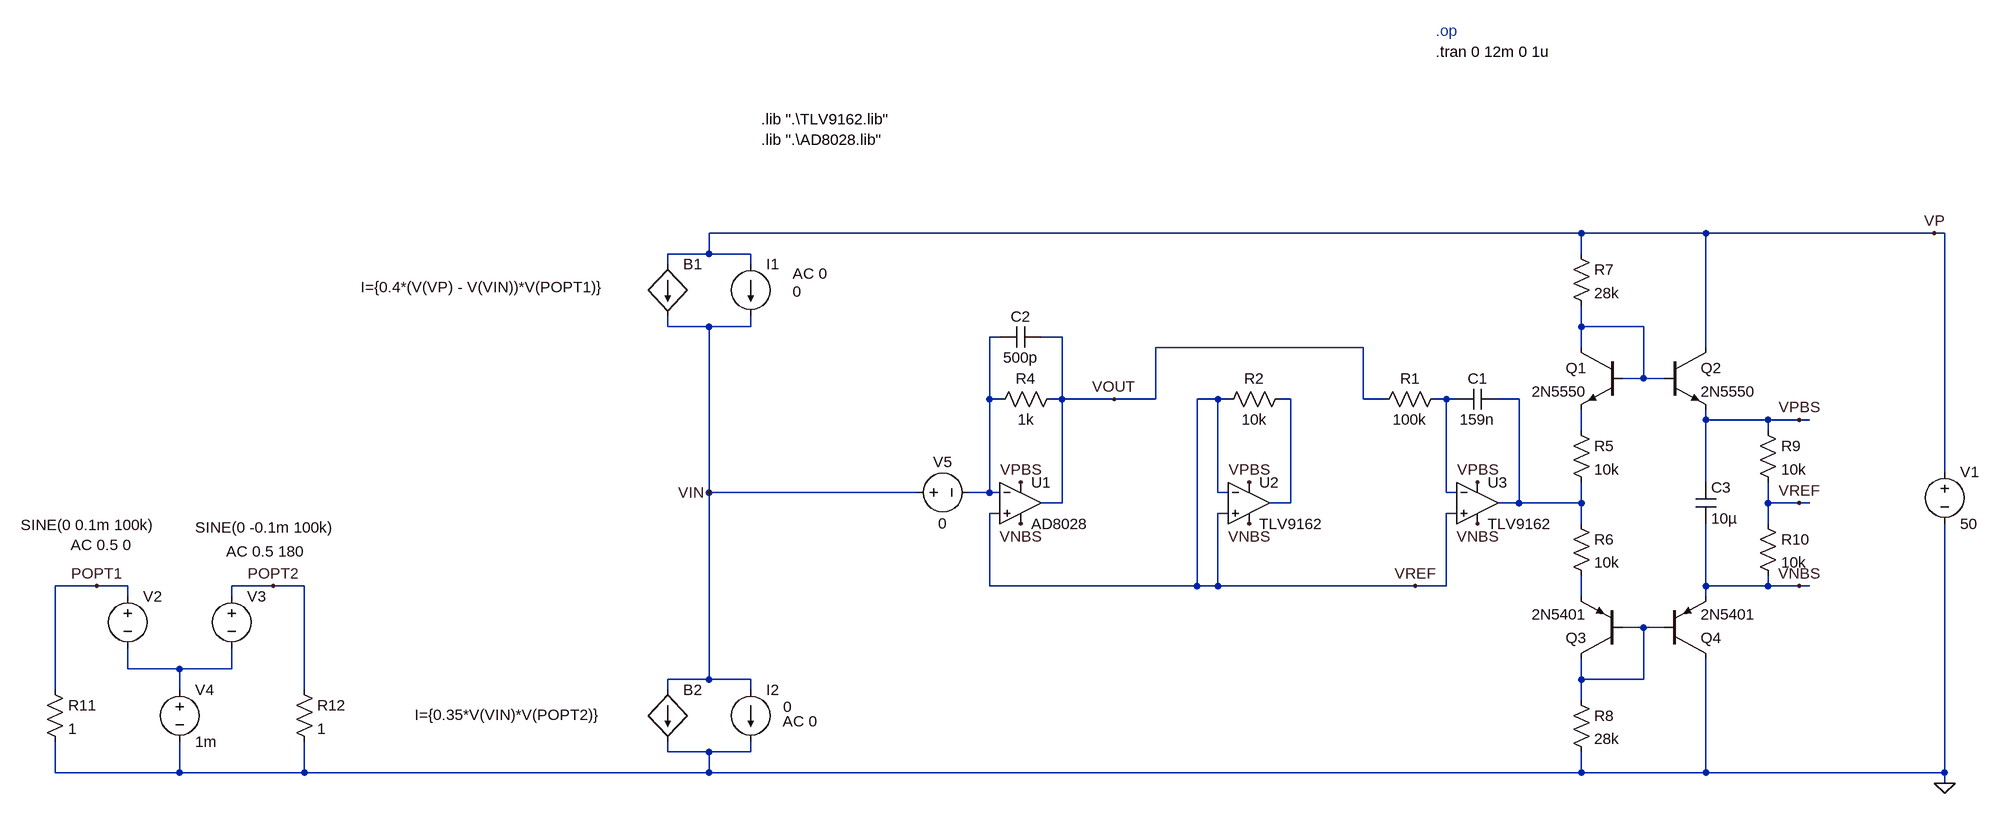
[diagram p0: schematic bootstrapping.asc]
bootstrapping.asc, the LTspice schematic file:
Version 4.1
SHEET 1 1864 1656
WIRE 1248 -48 -96 -48
WIRE 1440 -48 1248 -48
WIRE 1792 -48 1440 -48
WIRE 1808 -48 1792 -48
WIRE -96 -16 -96 -48
WIRE -96 -16 -160 -16
WIRE -32 -16 -96 -16
WIRE 1248 -16 1248 -48
WIRE -160 0 -160 -16
WIRE -32 0 -32 -16
WIRE -160 96 -160 80
WIRE -96 96 -160 96
WIRE -32 96 -32 80
WIRE -32 96 -96 96
WIRE 1248 96 1248 64
WIRE 1344 96 1248 96
WIRE 352 112 336 112
WIRE 448 112 416 112
WIRE 912 128 592 128
WIRE 1248 128 1248 96
WIRE 1440 128 1440 -48
WIRE 1344 176 1344 96
WIRE 1344 176 1312 176
WIRE 1376 176 1344 176
WIRE 336 208 336 112
WIRE 352 208 336 208
WIRE 448 208 448 112
WIRE 448 208 432 208
WIRE 528 208 448 208
WIRE 592 208 592 128
WIRE 592 208 528 208
WIRE 688 208 656 208
WIRE 704 208 688 208
WIRE 800 208 784 208
WIRE 912 208 912 128
WIRE 944 208 912 208
WIRE 1040 208 1024 208
WIRE 1056 208 1040 208
WIRE 1152 208 1120 208
WIRE 1440 240 1440 224
WIRE 1536 240 1440 240
WIRE 1584 240 1536 240
WIRE 1600 240 1584 240
WIRE 1248 256 1248 224
WIRE 1536 256 1536 240
WIRE 1808 320 1808 -48
WIRE 1440 336 1440 240
WIRE -96 352 -96 96
WIRE 224 352 -96 352
WIRE 336 352 336 208
WIRE 336 352 304 352
WIRE 352 352 336 352
WIRE 688 352 688 208
WIRE 704 352 688 352
WIRE 1040 352 1040 208
WIRE 1056 352 1040 352
WIRE 448 368 448 208
WIRE 448 368 416 368
WIRE 800 368 800 208
WIRE 800 368 768 368
WIRE 1152 368 1152 208
WIRE 1152 368 1120 368
WIRE 1248 368 1248 336
WIRE 1248 368 1152 368
WIRE 1536 368 1536 336
WIRE 1584 368 1536 368
WIRE 1600 368 1584 368
WIRE 352 384 336 384
WIRE 704 384 688 384
WIRE 1056 384 1040 384
WIRE 1248 400 1248 368
WIRE 1536 400 1536 368
WIRE -1040 496 -1104 496
WIRE -992 496 -1040 496
WIRE -768 496 -832 496
WIRE -720 496 -768 496
WIRE 336 496 336 384
WIRE 656 496 656 208
WIRE 656 496 336 496
WIRE 688 496 688 384
WIRE 688 496 656 496
WIRE 992 496 688 496
WIRE 1040 496 1040 384
WIRE 1040 496 992 496
WIRE 1440 496 1440 400
WIRE 1536 496 1536 480
WIRE 1536 496 1440 496
WIRE 1584 496 1536 496
WIRE 1600 496 1584 496
WIRE -992 512 -992 496
WIRE -832 512 -832 496
WIRE 1248 512 1248 480
WIRE 1440 512 1440 496
WIRE 1344 560 1312 560
WIRE 1376 560 1344 560
WIRE -992 624 -992 592
WIRE -912 624 -992 624
WIRE -832 624 -832 592
WIRE -832 624 -912 624
WIRE -96 640 -96 352
WIRE -96 640 -160 640
WIRE -32 640 -96 640
WIRE 1248 640 1248 608
WIRE 1344 640 1344 560
WIRE 1344 640 1248 640
WIRE -1104 656 -1104 496
WIRE -912 656 -912 624
WIRE -720 656 -720 496
WIRE -160 656 -160 640
WIRE -32 656 -32 640
WIRE 1248 672 1248 640
WIRE -160 752 -160 736
WIRE -96 752 -160 752
WIRE -32 752 -32 736
WIRE -32 752 -96 752
WIRE -1104 784 -1104 736
WIRE -912 784 -912 736
WIRE -912 784 -1104 784
WIRE -720 784 -720 736
WIRE -720 784 -912 784
WIRE -96 784 -96 752
WIRE -96 784 -720 784
WIRE 1248 784 1248 752
WIRE 1248 784 -96 784
WIRE 1440 784 1440 608
WIRE 1440 784 1248 784
WIRE 1808 784 1808 400
WIRE 1808 784 1440 784
WIRE 1808 800 1808 784
FLAG 384 336 VPBS
FLAG 736 336 VPBS
FLAG 1088 336 VPBS
FLAG 384 400 VNBS
FLAG 736 400 VNBS
FLAG 1088 400 VNBS
FLAG 1584 368 VREF
FLAG 992 496 VREF
FLAG 1584 240 VPBS
FLAG 1584 496 VNBS
FLAG 1792 -48 VP
FLAG 1808 800 0
FLAG -1040 496 POPT1
FLAG -768 496 POPT2
FLAG 528 208 VOUT
FLAG -96 352 VIN
SYMBOL OpAmps\\opamp2 384 304 R0
SYMATTR InstName U1
SYMATTR Value AD8028
SYMBOL OpAmps\\opamp2 736 304 R0
SYMATTR InstName U2
SYMATTR Value TLV9162
SYMBOL OpAmps\\opamp2 1088 304 R0
SYMATTR InstName U3
SYMATTR Value TLV9162
SYMBOL voltage 1808 304 R0
SYMATTR InstName V1
SYMATTR Value 50
SYMBOL npn 1312 128 M0
SYMATTR InstName Q1
SYMATTR Value 2N5550
SYMBOL npn 1376 128 R0
SYMATTR InstName Q2
SYMATTR Value 2N5550
SYMBOL pnp 1312 608 R180
SYMATTR InstName Q3
SYMATTR Value 2N5401
SYMBOL pnp 1376 608 M180
SYMATTR InstName Q4
SYMATTR Value 2N5401
SYMBOL cap 1120 192 R90
WINDOW 0 0 32 VBottom 2
WINDOW 3 32 32 VTop 2
SYMATTR InstName C1
SYMATTR Value 159n
SYMBOL res 1040 192 R90
WINDOW 0 0 56 VBottom 2
WINDOW 3 32 56 VTop 2
SYMATTR InstName R1
SYMATTR Value 100k
SYMBOL res 800 192 R90
WINDOW 0 0 56 VBottom 2
WINDOW 3 32 56 VTop 2
SYMATTR InstName R2
SYMATTR Value 10k
SYMBOL res 448 192 R90
WINDOW 0 0 56 VBottom 2
WINDOW 3 32 56 VTop 2
SYMATTR InstName R4
SYMATTR Value 1k
SYMBOL cap 416 96 R90
WINDOW 0 0 32 VBottom 2
WINDOW 3 32 32 VTop 2
SYMATTR InstName C2
SYMATTR Value 500p
SYMBOL res 1232 240 R0
SYMATTR InstName R5
SYMATTR Value 10k
SYMBOL res 1232 384 R0
SYMATTR InstName R6
SYMATTR Value 10k
SYMBOL res 1232 -32 R0
SYMATTR InstName R7
SYMATTR Value 28k
SYMBOL res 1232 656 R0
SYMATTR InstName R8
SYMATTR Value 28k
SYMBOL res 1520 240 R0
SYMATTR InstName R9
SYMATTR Value 10k
SYMBOL res 1520 384 R0
SYMATTR InstName R10
SYMATTR Value 10k
SYMBOL cap 1424 336 R0
SYMATTR InstName C3
SYMATTR Value 10µ
SYMBOL voltage -992 496 R0
WINDOW 123 -88 -63 Left 2
WINDOW 39 0 0 Left 0
WINDOW 3 -165 -94 Left 2
SYMATTR Value2 AC 0.5 0
SYMATTR Value SINE(0 0.1m 100k)
SYMATTR InstName V2
SYMBOL res -1120 640 R0
SYMATTR InstName R11
SYMATTR Value 1
SYMBOL voltage -832 496 R0
WINDOW 123 -8 -53 Left 2
WINDOW 39 0 0 Left 0
WINDOW 3 -56 -90 Left 2
SYMATTR Value2 AC 0.5 180
SYMATTR Value SINE(0 -0.1m 100k)
SYMATTR InstName V3
SYMBOL res -736 640 R0
SYMATTR InstName R12
SYMATTR Value 1
SYMBOL bi -160 0 R0
WINDOW 3 -473 35 Left 2
SYMATTR Value I={0.4*(V(VP) - V(VIN))*V(POPT1)}
SYMATTR InstName B1
SYMBOL bi -160 656 R0
WINDOW 3 -390 39 Left 2
SYMATTR Value I={0.35*V(VIN)*V(POPT2)}
SYMATTR InstName B2
SYMBOL current -32 0 R0
WINDOW 3 65 42 Left 2
WINDOW 123 65 14 Left 2
WINDOW 39 0 0 Left 0
SYMATTR Value 0
SYMATTR Value2 AC 0
SYMATTR InstName I1
SYMBOL current -32 656 R0
WINDOW 123 49 49 Left 2
WINDOW 39 0 0 Left 0
WINDOW 3 50 26 Left 2
SYMATTR Value2 AC 0
SYMATTR Value 0
SYMATTR InstName I2
SYMBOL voltage -912 640 R0
WINDOW 123 0 0 Left 0
WINDOW 39 0 0 Left 0
SYMATTR InstName V4
SYMATTR Value 1m
SYMBOL voltage 208 352 R270
WINDOW 0 32 56 VTop 2
WINDOW 3 -32 56 VBottom 2
WINDOW 123 0 0 Left 0
WINDOW 39 0 0 Left 0
SYMATTR InstName V5
SYMATTR Value 0
TEXT -16 -224 Left 2 !.lib ".\\TLV9162.lib"
TEXT 1024 -360 Left 2 ;.op
TEXT 1024 -328 Left 2 !.tran 0 12m 0 1u
TEXT -16 -192 Left 2 !.lib ".\\AD8028.lib"

The netlist it stands for:
* bootstrapping.asc
X§U1 VREF N002 VPBS VNBS VOUT AD8028  ; pins In+ In- V+ V- OUT
X§U2 VREF VREF VPBS VNBS N003 TLV9162  ; pins In+ In- V+ V- OUT
X§U3 VREF N004 VPBS VNBS N005 TLV9162  ; pins In+ In- V+ V- OUT
V1 VP 0 50
Q1 N001 N001 N006 0 2N5550
Q2 VP N001 VPBS 0 2N5550
Q3 N008 N008 N007 0 2N5401
Q4 0 N008 VNBS 0 2N5401
C1 N005 N004 159n
R1 N004 VOUT 100k
R2 N003 VREF 10k
R4 VOUT N002 1k
C2 VOUT N002 500p
R5 N006 N005 10k
R6 N005 N007 10k
R7 VP N001 28k
R8 N008 0 28k
R9 VPBS VREF 10k
R10 VREF VNBS 10k
C3 VPBS VNBS 10µ
V2 POPT1 N009 SINE(0 0.1m 100k) AC 0.5 0
R11 POPT1 0 1
V3 POPT2 N009 SINE(0 -0.1m 100k) AC 0.5 180
R12 POPT2 0 1
B1 VP VIN I={0.4*(V(VP) - V(VIN))*V(POPT1)}
B2 VIN 0 I={0.35*V(VIN)*V(POPT2)}
I1 VP VIN 0 AC 0
I2 VIN 0 0 AC 0
V4 N009 0 1m
V5 VIN N002 0
.model NPN NPN
.model PNP PNP
.lib standard.bjt
.lib ".\TLV9162.lib"
* .op
.tran 0 12m 0 1u
.lib ".\AD8028.lib"
.backanno
.end